# Altium schematic sheet Wireless.SchDoc
size A4
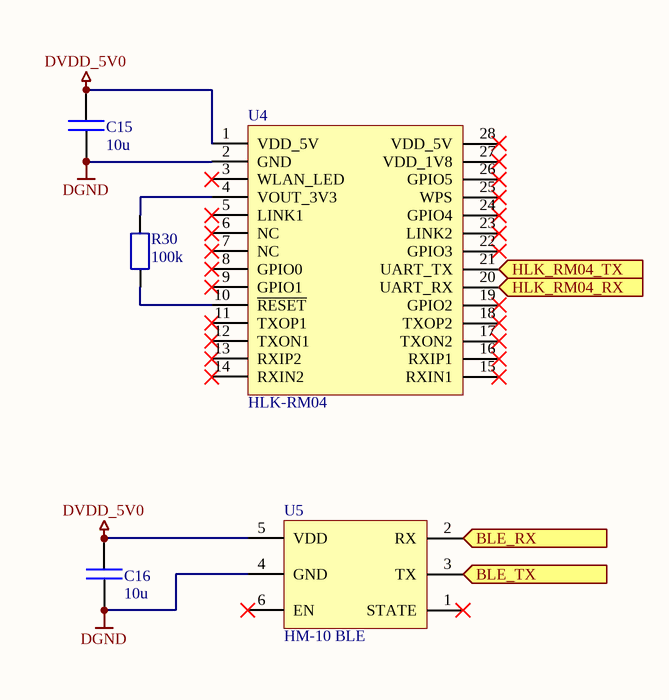
[diagram p0: Wireless.SchDoc]

## Parts
C15  10u  [C_1206/3216]
C16  10u  [C_1206/3216]
R30  100k  [R_0603/1608]
U4  HLK-RM04  [HLK-RM04]
U5  HM-10 BLE  [HM-10]

## Ports
BLE_RX, BLE_TX, HLK_RM04_RX, HLK_RM04_TX

## Nets
DGND: C15.2 C16.2 U4.2(GND) U5.4(GND)
DVDD_5V0: C15.1 C16.1 U4.1(VDD_5V) U5.5(VDD)
BLE_RX: U5.2(RX) ; port BLE_RX
BLE_TX: U5.3(TX) ; port BLE_TX
HLK_RM04_RX: U4.20(UART_RX) ; port HLK_RM04_RX
HLK_RM04_TX: U4.21(UART_TX) ; port HLK_RM04_TX
NetR30_1: R30.1 U4.4(VOUT_3V3)
NetR30_2: R30.2 U4.10(~{RESET})

Not connected (* = marked no-connect by the designer): U4 0(EP) 3(WLAN_LED)* 5(LINK1)* 6(NC)* 7(NC)* 8(GPIO0)* 9(GPIO1)* 11(TXOP1)* 12(TXON1)* 13(RXIP2)* 14(RXIN2)* 15(RXIN1)* 16(RXIP1)* 17(TXON2)* 18(TXOP2)* 19(GPIO2)* 22(GPIO3)* 23(LINK2)* 24(GPIO4)* 25(WPS)* 26(GPIO5)* 27(VDD_1V8)* 28(VDD_5V)*; U5 0(EP) 1(STATE)* 6(EN)*

## Library data of the parts
C15 C16 = Capacitor: Non-polarized capacitor
R30 = Resistor
U4 = HLK-RM04: WIFI-UART bridge
U5 = HM-10 BLE: BLE-UART bridge